# EAGLE design fabflash-mk-2.1-driver (EAGLE 6.5.0)
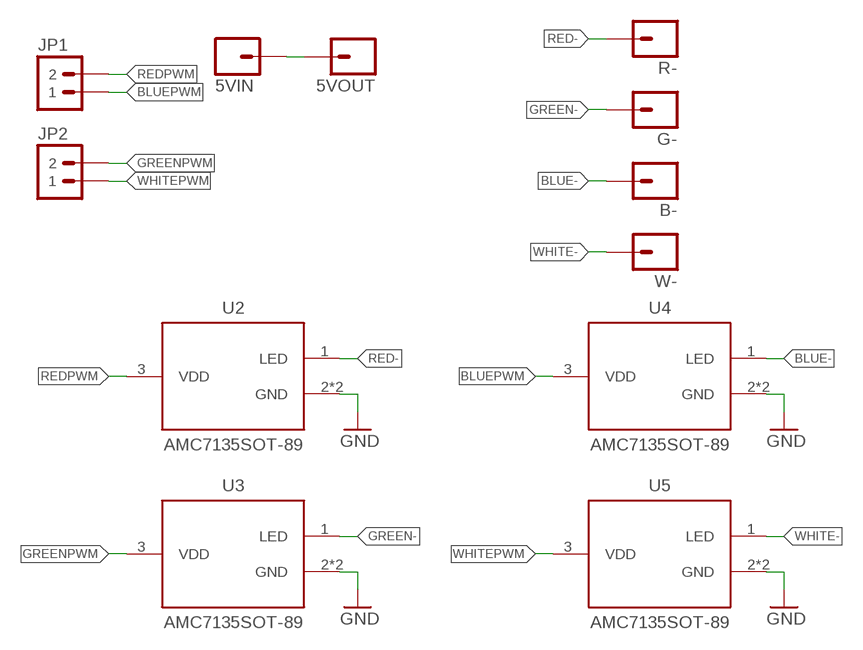
[diagram p0: schematic, sheet 1]

## Parts
5VIN  M01SMD_2X3MM  [1X01_SMD_2X3MM]
5VOUT  M01SMD_2X3MM  [1X01_SMD_2X3MM]
B-  M01SMD_2X3MM  [1X01_SMD_2X3MM]
G-  M01SMD_2X3MM  [1X01_SMD_2X3MM]
JP1  M02PTH-2MM  [1X02-2MM-PTH]
JP2  M02PTH-2MM  [1X02-2MM-PTH]
R-  M01SMD_2X3MM  [1X01_SMD_2X3MM]
U2  AMC7135SOT-89  [SOT89]
U3  AMC7135SOT-89  [SOT89]
U4  AMC7135SOT-89  [SOT89]
U5  AMC7135SOT-89  [SOT89]
W-  M01SMD_2X3MM  [1X01_SMD_2X3MM]

## Nets
BLUE-: B-.P$1 U4.1(LED)
BLUEPWM: JP1.P$1 U4.3(VDD)
GND: U2.2(GND) U2.4(GND) U3.2(GND) U3.4(GND) U4.2(GND) U4.4(GND) U5.2(GND) U5.4(GND)
GREEN-: G-.P$1 U3.1(LED)
GREENPWM: JP2.P$2 U3.3(VDD)
N$1: 5VIN.P$1 5VOUT.P$1
RED-: R-.P$1 U2.1(LED)
REDPWM: JP1.P$2 U2.3(VDD)
WHITE-: U5.1(LED) W-.P$1
WHITEPWM: JP2.P$1 U5.3(VDD)

## Library data of the parts
5VIN 5VOUT B- G- R- W- = A_butts:M01: Header 1 Standard 1-pin 0.1" header. Use with straight break away headers (SKU : PRT-00116), right angle break away headers (PRT-00553), swiss pins (PRT-00743), machine pins (PRT-00117), and female headers (PRT-00115).
JP1 JP2 = A_butts:M02: Standard 2-pin 0.1" header. Use with - straight break away headers ( PRT-00116) - right angle break away headers (PRT-00553) - swiss pins (PRT-00743) - machine pins (PRT-00117) - female headers (PRT-00115) Molex polarized connector foot print use with: PRT-08233 with associated crimp pins and housings. 2.54_SCREWTERM for use with PRT-10571. 3.5mm Screw Terminal footprints for PRT-08084 5mm Screw Terminal footprints for use with PRT-08433
U2-U5 = A_butts:AMC7135

## Board
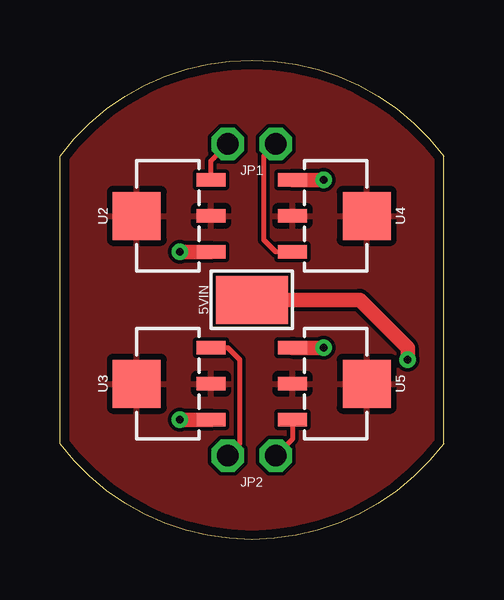
[diagram p1: board, top side]
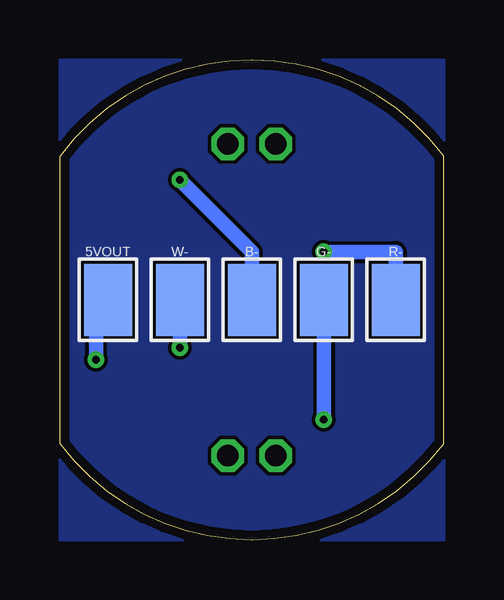
[diagram p2: board, bottom side, seen from below]

Size 16 x 20 mm. Coordinates in mm from the lower left corner, seen from the top.
Outline: 0,16 arc-53 8,20 arc-53 16,16 16,4 arc-53 8,0 arc-53 0,4 0,16
Copper layers (1*16): Top 0.0356mm / dielectric 1.5011mm / Bottom 0.0356mm
Design rules "LaenPCBOrder2": minimum track width 6mil, minimum drill 13mil, track to track 6mil, track to pad 6mil, pad to pad 6mil, via to via 6mil, smd to smd 6mil, copper to edge 15mil, drill to drill 6mil, minimum pad ring 7mil, minimum via ring 7mil, stop-mask expansion 3mil, vias tented up to drill 20mil, thermal gap 10mil

### Footprints (pad centres in the part's own frame; a part is rotated, then mirrored left to right if it is on the bottom)
1X01_SMD_2X3MM = smd 2 x 3: P$1 0,0
1X02-2MM-PTH = drill 0.9 octagon: P$1 -1,0; P$2 1,0
SOT89 = smd 0.58 x 1.2: 1 -1.5,-1.8; 2 0,-1.8; 3 1.5,-1.8 | smd 2 x 2: 4 0,1.3

### Placement (x,y rotation side)
5VIN  8,10 90 top
5VOUT  14,10 0 bottom
B-  8,10 0 bottom
G-  5,10 0 bottom
JP1  8,16.5 180 top
JP2  8,3.5 180 top
R-  2,10 0 bottom
U2  4.5,13.5 90 top
U3  4.5,6.5 90 top
U4  11.5,13.5 270 top
U5  11.5,6.5 270 top
W-  11,10 0 bottom

### Tracks (layer width: path | path; a pad name or v marks a point on that pad's centre or on a via)
BLUE-  (via drill 0.33)
  Top 0.61: v11,15 U4.1
  Bottom 0.61: B-.P$1 8,12 v11,15
BLUEPWM
  Top 0.2: U4.3 9,12 8.5,12.5 8.5,16 JP1.P$1
GND
  pour Top: 0,0 0,20 16,20 16,0
  pour Bottom: 0,0 0,20 16,20 16,0
GREEN-  (via drill 0.33)
  Top 0.61: U3.1 v5,5
  Bottom 0.61: G-.P$1 v5,5
GREENPWM
  Top 0.2: JP2.P$2 7.5,4 7.5,7.5 7,8 U3.3
N$1  (via drill 0.33)
  Top 0.61: 5VIN.P$1 12.5,10 14.5,8 v14.5,7.5
  Bottom 0.61: v14.5,7.5 14.5,9.5 5VOUT.P$1
RED-  (via drill 0.33)
  Top 0.61: U2.1 v5,12
  Bottom 0.61: v5,12 2,12 R-.P$1
REDPWM
  Top 0.2: U2.3 6.3,15.8 JP1.P$2
WHITE-  (via drill 0.33)
  Top 0.61: U5.1 v11,8
  Bottom 0.61: W-.P$1 v11,8
WHITEPWM
  Top 0.2: U5.3 9.7,4.2 JP2.P$1